# EAGLE schematic motores (EAGLE 9.6.2)
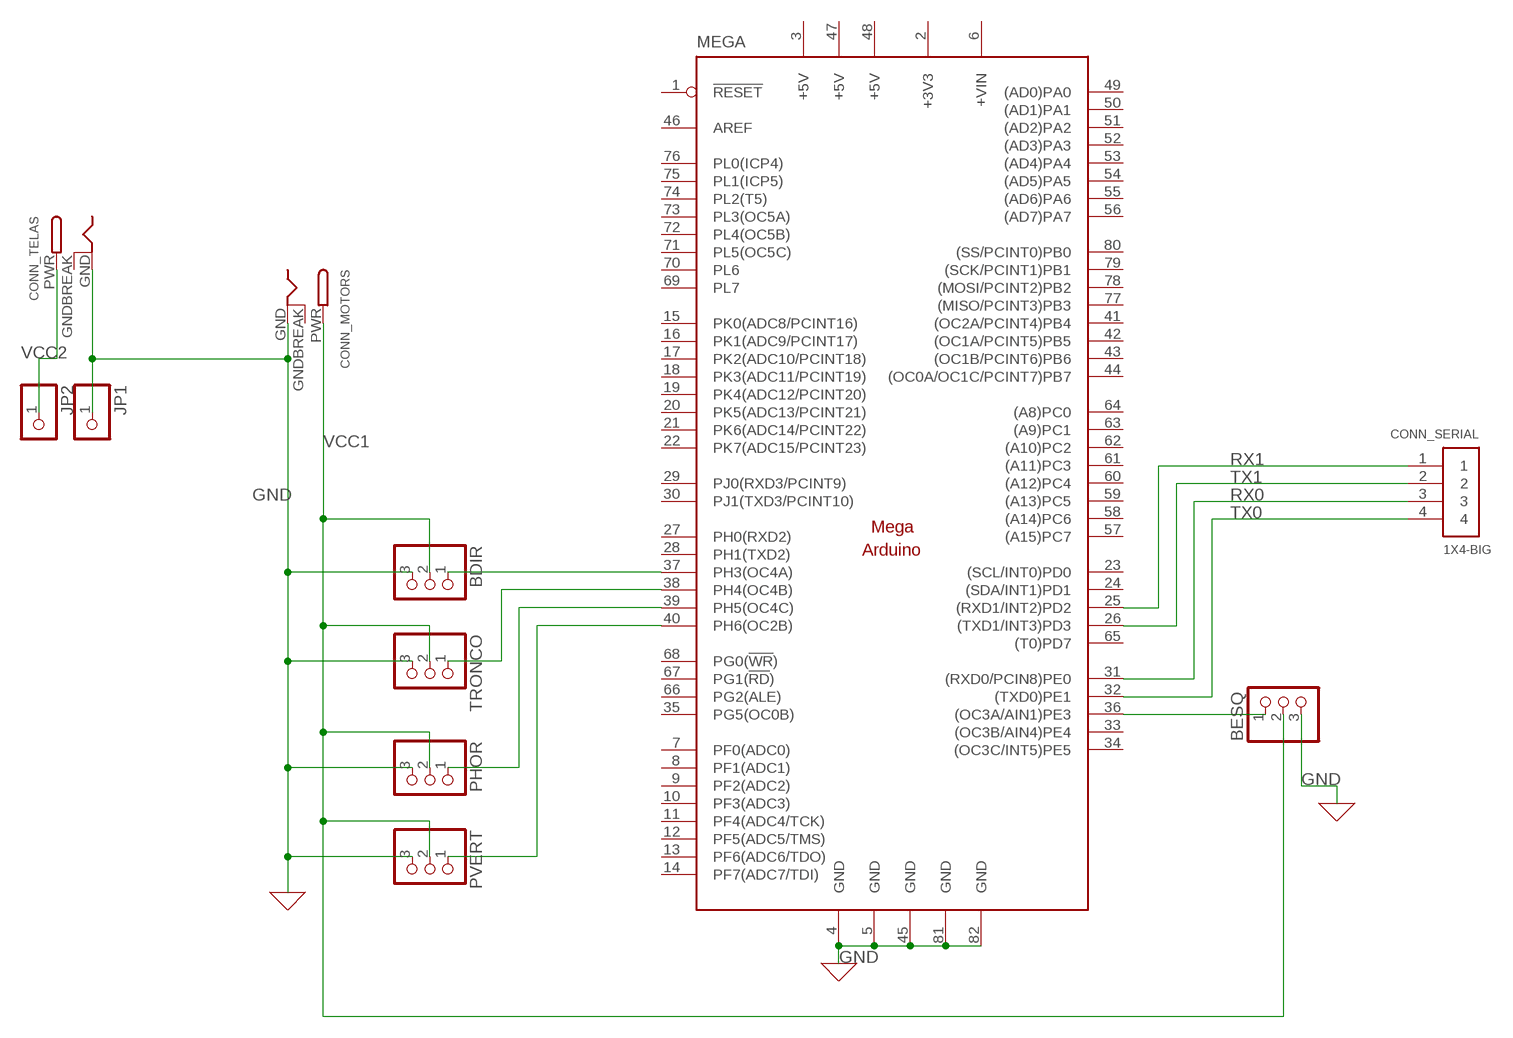
[diagram p0: schematic, sheet 1]

## Parts
BDIR  PINHD-1X3  [1X03]
BESQ  PINHD-1X3  [1X03]
CONN_MOTORS  DCBARRELPTH  [DCJACK_2MM_PTH]
CONN_SERIAL  1X4-BIG  [1X04-BIG]
CONN_TELAS  DCBARRELPTH  [DCJACK_2MM_PTH]
JP1  PINHD-1X1  [1X01]
JP2  PINHD-1X1  [1X01]
MEGA  MEGAARDUINO_11  [MEGA_ARDUINO_1]
PHOR  PINHD-1X3  [1X03]
PVERT  PINHD-1X3  [1X03]
TRONCO  PINHD-1X3  [1X03]

## Nets
GND: BDIR.3 BESQ.3 CONN_MOTORS.GND CONN_TELAS.GND JP1.1 MEGA.4(GND) MEGA.5(GND) MEGA.45(GND) MEGA.81(GND) MEGA.82(GND) PHOR.3 PVERT.3 TRONCO.3
N$1: BDIR.1 MEGA.37(PH3(OC4A))
N$2: MEGA.38(PH4(OC4B)) TRONCO.1
N$4: MEGA.39(PH5(OC4C)) PHOR.1
N$5: MEGA.40(PH6(OC2B)) PVERT.1
N$6: BESQ.1 MEGA.36((OC3A/AIN1)PE3)
RX0: CONN_SERIAL.3 MEGA.31((RXD0/PCIN8)PE0)
RX1: CONN_SERIAL.1 MEGA.25((RXD1/INT2)PD2)
TX0: CONN_SERIAL.4 MEGA.32((TXD0)PE1)
TX1: CONN_SERIAL.2 MEGA.26((TXD1/INT3)PD3)
VCC1 [corrente]: BDIR.2 BESQ.2 CONN_MOTORS.PWR PHOR.2 PVERT.2 TRONCO.2
VCC2 [corrente]: CONN_TELAS.PWR JP2.1
Unconnected: MEGA.1(!RESET) MEGA.7(PF0(ADC0)) MEGA.8(PF1(ADC1)) MEGA.9(PF2(ADC2)) MEGA.10(PF3(ADC3)) MEGA.11(PF4(ADC4/TCK)) MEGA.12(PF5(ADC5/TMS)) MEGA.13(PF6(ADC6/TDO)) MEGA.14(PF7(ADC7/TDI)) MEGA.15(PK0(ADC8/PCINT16)) MEGA.16(PK1(ADC9/PCINT17)) MEGA.17(PK2(ADC10/PCINT18)) MEGA.18(PK3(ADC11/PCINT19)) MEGA.19(PK4(ADC12/PCINT20)) MEGA.20(PK5(ADC13/PCINT21)) MEGA.21(PK6(ADC14/PCINT22)) MEGA.22(PK7(ADC15/PCINT23)) MEGA.23((SCL/INT0)PD0) MEGA.24((SDA/INT1)PD1) MEGA.27(PH0(RXD2)) MEGA.28(PH1(TXD2)) MEGA.29(PJ0(RXD3/PCINT9)) MEGA.30(PJ1(TXD3/PCINT10)) MEGA.33((OC3B/AIN4)PE4) MEGA.34((OC3C/INT5)PE5) MEGA.35(PG5(OC0B)) MEGA.41((OC2A/PCINT4)PB4) MEGA.42((OC1A/PCINT5)PB5) MEGA.43((OC1B/PCINT6)PB6) MEGA.44((OC0A/OC1C/PCINT7)PB7) MEGA.46(AREF) MEGA.49((AD0)PA0) MEGA.50((AD1)PA1) MEGA.51((AD2)PA2) MEGA.52((AD3)PA3) MEGA.53((AD4)PA4) MEGA.54((AD5)PA5) MEGA.55((AD6)PA6) MEGA.56((AD7)PA7) MEGA.57((A15)PC7) MEGA.58((A14)PC6) MEGA.59((A13)PC5) MEGA.60((A12)PC4) MEGA.61((A11)PC3) MEGA.62((A10)PC2) MEGA.63((A9)PC1) MEGA.64((A8)PC0) MEGA.65((T0)PD7) MEGA.66(PG2(ALE)) MEGA.67(PG1(!RD!)) MEGA.68(PG0(!WR!)) MEGA.69(PL7) MEGA.70(PL6) MEGA.71(PL5(OC5C)) MEGA.72(PL4(OC5B)) MEGA.73(PL3(OC5A)) MEGA.74(PL2(T5)) MEGA.75(PL1(ICP5)) MEGA.76(PL0(ICP4)) MEGA.77((MISO/PCINT3)PB3) MEGA.78((MOSI/PCINT2)PB2) MEGA.79((SCK/PCINT1)PB1) MEGA.80((SS/PCINT0)PB0)

## Power pins joined to a net without a drawn wire
+3V3: MEGA.2(+3V3)
+5V: MEGA.3(+5V) MEGA.47(+5V) MEGA.48(+5V)
+VIN: MEGA.6(+VIN)
GNDBREAK: CONN_MOTORS.GNDBREAK CONN_TELAS.GNDBREAK

## Library data of the parts
BDIR BESQ PHOR PVERT TRONCO = adafruit:PINHD-1X3: PIN HEADER
CONN_MOTORS CONN_TELAS = adafruit:DCBARREL: 2.0mm DC Barrel Jack DCJACK_2MM_PTH - Through Hole Jack (4UConnector: 05537)
CONN_SERIAL = adafruit:1X4: 4-pin connector
JP1 JP2 = adafruit:PINHD-1X1: Pin header 1x1 for 0.1" spacing With round pins
MEGA = arduino:MEGAARDUINO_1: The Arduino Mega is a microcontroller board based on the ATmega1280. - 54 digital input/output pins (of which 14 can be used as PWM outputs) - 16 analog inputs - 4 UARTs (hardware serial ports) - 16 MHz crystal oscillator - USB connection - power jack - ICSP header - reset button It contains everything needed to support the microcontroller; simply connect it to a computer with a USB cable or power it with a AC-to-DC adapter or battery to get started. The Mega is compatible with most shields designed for the Arduino Duemilanove or Diecimila. http://arduino.cc/en/Main/ArduinoBoardMega

## Net classes
0 default: width 0.508 mm, clearance 0.5 mm
1 corrente: width 1.016 mm, clearance 0.5 mm